# EasyEDA Pro project ProDoc_PCB1_2025-02-22.epro

# Board PCB1
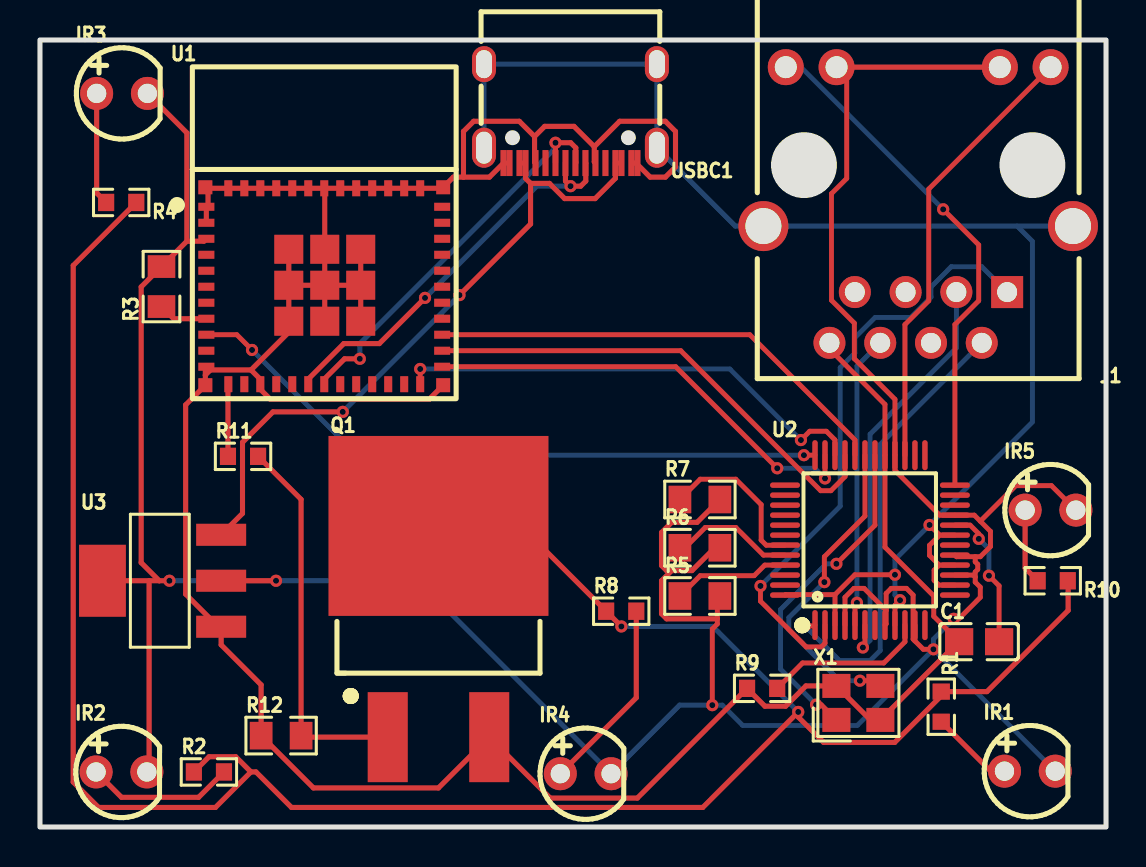
[diagram p0: board, top side]
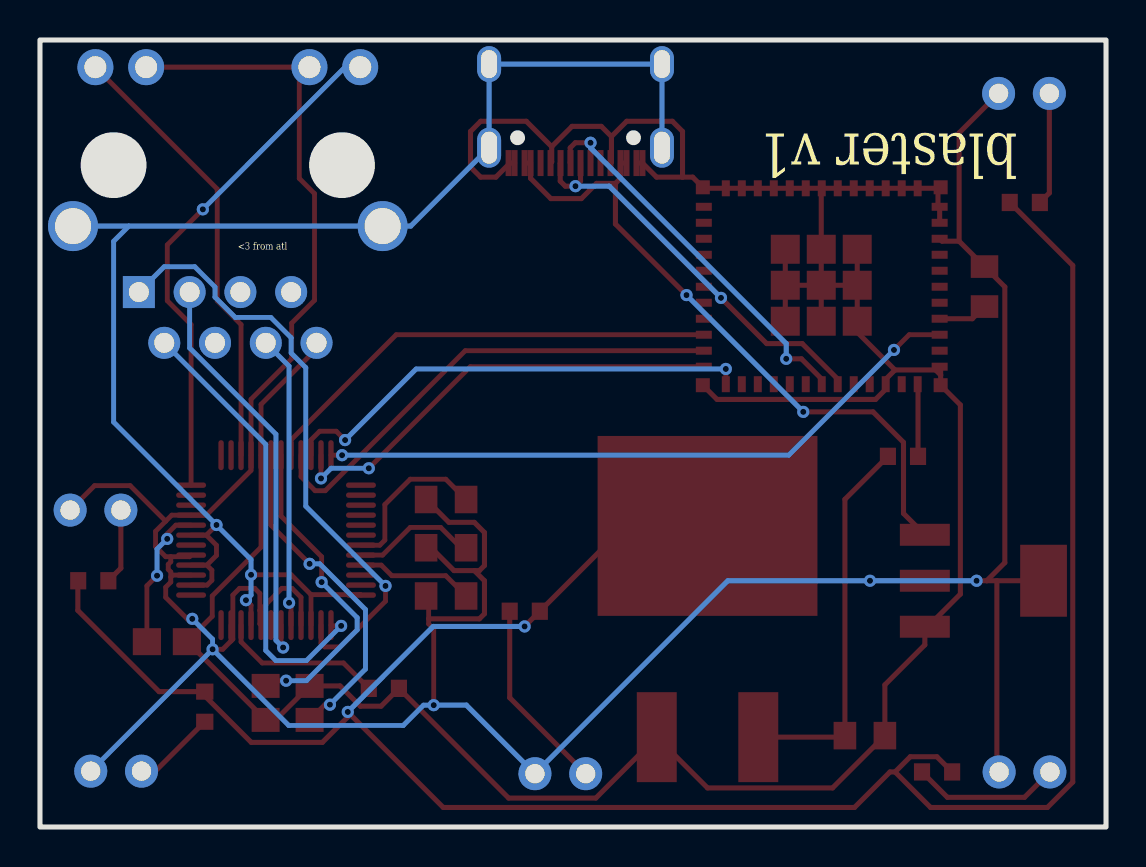
[diagram p1: board, bottom side, seen from below]

Outline 53.34 x 39.37 mm; copper layers: Top Layer, Inner1, Inner2, Bottom Layer. Coordinates in mm from the lower left corner of the outline.
Outline path: rectangle 0,39.37 53.34,0
Stack: Top Layer 0.035mm Outer layer thickness 1oz / Dielectric1 0.2104mm 7628 RC49% 8.6mil / Inner1 0.0152mm Inner layer thickness / Dielectric2 1.065mm 1.1mm H/HOZ Copper / Inner2 0.0152mm Inner layer thickness / Dielectric3 0.2104mm 7628 RC49% 8.6mil / Bottom Layer 0.035mm Outer layer thickness 1oz

## Design rules (mm)
template: JLCPCB Capability(Two Layers Board)
spacing copperThickness1oz (default): track to track 0.102, other pairs 0.152 to 0.3
spacing copperThickness2oz: track to track 0.203, other pairs 0.152 to 0.3
track width copperThickness1oz (default): min 0.127, default 0.254, max 2.54
track width copperThickness2oz: min 0.203, default 0.254, max 2.54
differential pair differentialPair (default): width min 0.127, default 0.254, max 2.54; gap min 0.152, default 0.152
via viaSize (default): diameter min 0.5, default 0.61, max 10; hole min 0.3, default 0.305, max 6.3

## Placement (name value [footprint] x y rotation side)
C1  4.7uF  [C0805]  46.99 9.27 0 top
IR1  HIR204C  [LED-TH_BD4.2-P2.54-FD]  49.53 2.79 0 top
IR2  HIR204C  [LED-TH_BD4.2-P2.54-FD]  4.08 2.75 0 top
IR3  HIR204C  [LED-TH_BD4.2-P2.54-FD]  4.11 36.7 0 top
IR4  HIR204C  [LED-TH_BD4.2-P2.54-FD]  27.3 2.67 0 top
IR5  HIR204C  [LED-TH_BD4.2-P2.54-FD]  50.56 15.85 0 top
J1  HR911105A  [RJ45-TH_HR911105A]  43.94 31.11 180 top
Q1  IRLZ34NSTRLPBF  [DPAK_L10.2-W9.1-P5.08-LS15.2-BL-CW]  19.94 9.78 0 top
R1  75Ω  [R0603]  45.1 6.02 270 top
R2  75Ω  [R0603]  8.45 2.75 0 top
R3  10kΩ  [R0805]  6.08 27.03 90 top
R4  75Ω  [R0603]  4.06 31.24 180 top
R5  10kΩ  [R0805]  33.02 11.56 0 top
R6  10kΩ  [R0805]  33.02 13.97 0 top
R7  10kΩ  [R0805]  33.02 16.38 0 top
R8  75Ω  [R0603]  29.08 10.8 0 top
R9  12.4kΩ  [R0603]  36.13 6.94 0 top
R10  75Ω  [R0603]  50.67 12.32 180 top
R11  220Ω  [R0603]  10.16 18.54 0 top
R12  10kΩ  [R0805]  12.06 4.57 0 top
U1  ESP32-C6-MINI-1-N4  [WIFIM-SMD_61P-L16.6-W13.2-P0.80-ESP32-C6-MINI-1-N4]  14.22 27.05 0 top
U2  W5500  [LQFP-48_L7.0-W7.0-P0.50-LS9.0-BL]  41.53 14.35 0 top
U3  AMS1117-3.3V  [SOT-223-3_L6.5-W3.4-P2.30-LS7.0-BR]  6.1 12.32 0 top
USBC1  TYPE-C-31-M-12  [USB-C_SMD-TYPE-C-31-M-12]  26.54 35.69 180 top
X1  25MHz  [CRYSTAL-SMD_4P-L3.2-W2.5-BL]  40.95 6.21 0 top

## Footprints (pads in the part's own frame, mm; a bottom-side part is the same pattern mirrored in y, then rotated)
C0805
  rect 1.41x1.35 smd: 1(-1,0) 2(1,0)
CRYSTAL-SMD_4P-L3.2-W2.5-BL
  rect 1.4x1.2 smd: 1(-1.1,-0.85) 2(1.1,-0.85) 3(1.1,0.85) 4(-1.1,0.85)
DPAK_L10.2-W9.1-P5.08-LS15.2-BL-CW
  rect 2x4.5 smd: 1(-2.54,-5.284) 3(2.54,-5.284)
  rect 11x9 smd: 2(0,5.284)
LED-TH_BD4.2-P2.54-FD
  round 1.651 hole 0.965: 1(-1.27,0) 2(1.27,0)
LQFP-48_L7.0-W7.0-P0.50-LS9.0-BL
  oval 0.27x1.5 smd: 1(-2.75,-4.25) 2(-2.25,-4.25) 3(-1.75,-4.25) 4(-1.25,-4.25) 5(-0.75,-4.25) 6(-0.25,-4.25) 7(0.25,-4.25) 8(0.75,-4.25) 9(1.25,-4.25) 10(1.75,-4.25) 11(2.25,-4.25) 12(2.75,-4.25) 25(2.75,4.25) 26(2.25,4.25) 27(1.75,4.25) 28(1.25,4.25) 29(0.75,4.25) 30(0.25,4.25) 31(-0.25,4.25) 32(-0.75,4.25) 33(-1.25,4.25) 34(-1.75,4.25) 35(-2.25,4.25) 36(-2.75,4.25)
  oval 1.5x0.27 smd: 13(4.25,-2.75) 14(4.25,-2.25) 15(4.25,-1.75) 16(4.25,-1.25) 17(4.25,-0.75) 18(4.25,-0.25) 19(4.25,0.25) 20(4.25,0.75) 21(4.25,1.25) 22(4.25,1.75) 23(4.25,2.25) 24(4.25,2.75) 37(-4.25,2.75) 38(-4.25,2.25) 39(-4.25,1.75) 40(-4.25,1.25) 41(-4.25,0.75) 42(-4.25,0.25) 43(-4.25,-0.25) 44(-4.25,-0.75) 45(-4.25,-1.25) 46(-4.25,-1.75) 47(-4.25,-2.25) 48(-4.25,-2.75)
R0603
  rect 0.806x0.864 smd: 1(-0.753,0) 2(0.753,0)
R0805
  rect 1.133x1.377 smd: 1(-1,0) 2(1,0)
RJ45-TH_HR911105A
  rect 1.6x1.6 hole 1: 1(-4.45,4.355)
  round 1.6 hole 1: 2(-3.18,6.895) 3(-1.91,4.355) 4(-0.64,6.895) 5(0.63,4.355) 6(1.9,6.895) 7(3.17,4.355) 8(4.44,6.895)
  round 1.8 hole 1.1: 9(-6.625,-6.895) 10(-4.085,-6.895) 11(4.085,-6.895) 12(6.625,-6.895)
  round 2.5 hole 1.8: SH1(-7.745,1.055) SH2(7.745,1.055)
SOT-223-3_L6.5-W3.4-P2.30-LS7.0-BR
  rect 2.5x1.1 smd: 1(2.97,-2.3) 2(2.97,0) 3(2.97,2.3)
  rect 2.34x3.6 smd: 4(-2.97,0)
USB-C_SMD-TYPE-C-31-M-12
  oval 1.2x2 hole 0.8x1.6: 0(-4.325,1.706) 1(4.325,1.706)
  oval 1.2x1.8 hole 0.8x1.4: 2(4.325,-2.474) 3(-4.325,-2.474)
  rect 0.3x1.3 smd: A1(-3.35,2.474) A4(-2.55,2.474) A5(-1.25,2.474) A6(-0.25,2.474) A7(0.25,2.474) A8(1.25,2.474) A9(2.55,2.474) A12(3.35,2.474) B1(3.05,2.474) B4(2.25,2.474) B5(1.75,2.474) B6(0.75,2.474) B7(-0.75,2.474) B8(-1.75,2.474) B9(-2.25,2.474) B12(-3.05,2.474)
WIFIM-SMD_61P-L16.6-W13.2-P0.80-ESP32-C6-MINI-1-N4
  rect 0.8x0.4 smd: 1(-5.9,3.975) 2(-5.9,3.175) 3(-5.9,2.375) 4(-5.9,1.575) 5(-5.9,0.775) 6(-5.9,-0.025) 7(-5.9,-0.825) 8(-5.9,-1.625) 9(-5.9,-2.425) 10(-5.9,-3.225) 11(-5.9,-4.025) 25(5.9,-4.025) 26(5.9,-3.225) 27(5.9,-2.425) 28(5.9,-1.625) 29(5.9,-0.825) 30(5.9,-0.025) 31(5.9,0.775) 32(5.9,1.575) 33(5.9,2.375) 34(5.9,3.175) 35(5.9,3.975)
  rect 0.4x0.8 smd: 12(-4.8,-4.9) 13(-4,-4.9) 14(-3.2,-4.9) 15(-2.4,-4.9) 16(-1.6,-4.9) 17(-0.8,-4.9) 18(0,-4.9) 19(0.8,-4.9) 20(1.6,-4.9) 21(2.4,-4.9) 22(3.2,-4.9) 23(4,-4.9) 24(4.8,-4.9) 36(4.8,4.9) 37(4,4.9) 38(3.2,4.9) 39(2.4,4.9) 40(1.6,4.9) 41(0.8,4.9) 42(0,4.9) 43(-0.8,4.9) 44(-1.6,4.9) 45(-2.4,4.9) 46(-3.2,4.9) 47(-4,4.9) 48(-4.8,4.9)
  rect 1.45x1.45 smd: 49(-1.775,1.85) 49(-1.775,0.05) 49(-1.775,-1.75) 49(0.025,1.85) 49(0.025,0.05) 49(0.025,-1.75) 49(1.825,1.85) 49(1.825,0.05) 49(1.825,-1.75)
  rect 0.7x0.7 smd: 50(5.95,4.95) 51(5.95,-4.95) 52(-5.95,-4.95) 53(-5.95,4.95)

## Nets
+5V: U3.3 USBC1.A4 USBC1.A9 USBC1.B4 USBC1.B9
AGND: J1.SH1 J1.SH2 U2.3 U2.9 U2.14 U2.16 U2.19 U2.48 USBC1.0 USBC1.1 USBC1.2 USBC1.3
GND: C1.1 J1.8 Q1.3 R9.1 R12.1 U1.1 U1.2 U1.11 U1.14 U1.36 U1.37 U1.38 U1.39 U1.40 U1.41 U1.42 U1.43 U1.44 U1.45 U1.46 U1.47 U1.48 U1.49 U1.50 U1.51 U1.52 U1.53 U2.29 U3.1 USBC1.A1 USBC1.A5 USBC1.A12 USBC1.B1 USBC1.B5 USBC1.B12 X1.2 X1.4
VCC: IR1.2 IR2.2 IR3.2 IR4.2 IR5.2 J1.10 J1.11 R3.2 R5.2 R6.2 R7.2 U1.3 U2.4 U2.8 U2.11 U2.15 U2.17 U2.21 U2.28 U3.2 U3.4
ACTLED: J1.9 U2.27
CLK: U1.26 U2.33
CS: U1.27 U2.32
DRAIN: Q1.2 R1.1 R2.1 R4.1 R8.1 R10.1
INT: U1.9 U2.36
IO0: R11.1 U1.12
MISO: U1.24 U2.34
MOSI: U1.25 U2.35
RXN: J1.6 U2.5
RXP: J1.3 U2.6
SPDLED: J1.12 U2.24
TXN: J1.2 U2.1
TXP: J1.1 U2.2
USBDM: U1.17 USBC1.A7 USBC1.B7
USBDP: U1.18 USBC1.A6 USBC1.B6
$1N1656: C1.2 U2.20
$1N1729: R9.2 U2.10
$1N1975: U2.31 X1.3
$1N1980: U2.30 X1.1
$1N2898: R5.1 U2.45
$1N2937: R6.1 U2.44
$1N2976: R7.1 U2.43
$1N3133: R3.1 U1.8
$1N4218: Q1.1 R11.2 R12.2
$1N5126: IR1.1 R1.2
$1N5129: IR2.1 R2.2
$1N5132: IR3.1 R4.2
$1N5135: IR4.1 R8.2
$1N5138: IR5.1 R10.2

Pads without a net: J1 4 5 7; U1 4 5 6 7 10 13 15 16 19 20 21 22 23 28 29 30 31 32 33 34 35; U2 7 12 13 18 22 23 25 26 37 38 39 40 41 42 46 47; USBC1 A8 B8

## Via types
v1: diameter 0.61, hole 0.305, Top Layer to Bottom Layer, 33 vias

## Routing (per net, layer and track width the routed paths; a pad name or vN(x,y) marks a point on that pad's centre or on a via; arc(x,y) is an arc through that point)
+5V: length 33.5
  Top Layer w0.254: v1(20.99,26.61) 24.55,30.16 24.55,32.2 ; v1(15.15,20.77) 11.66,20.77 10.13,19.24 10.13,15.69 U3.3 ; 24.55,32.2 24.29,32.45 USBC1.B4 USBC1.A9 ; 24.55,32.2 25.49,32.2 26.25,31.44 27.78,31.44 28.79,32.45 USBC1.B9 USBC1.A4
  Bottom Layer w0.254: v1(20.99,26.61) v1(15.15,20.77)
AGND: length 76.4
  Top Layer w0.243: 39.78,11.62 37.3,11.62 U2.48 ; 39.78,11.62 40.77,12.62 v1(42.78,12.62) ; 39.78,11.62 U2.3 ; 44.99,13.1 44.51,13.58 44.51,14.09 45.02,14.6 ; 44.99,13.1 44.74,12.85 44.74,12.34 44.98,12.1 U2.14 ; 44.99,13.1 U2.16 ; v1(44.51,15.11) 45.02,14.6 ; 45.02,14.6 U2.19 ; U2.9 42.78,11.09 v1(43.03,11.35)
  Bottom Layer w0.243: v1(43.03,11.35) 42.78,11.6 v1(42.78,12.62) 42.78,13.38 v1(44.51,15.11) 49.65,20.25 49.65,29.3 48.89,30.06
  Bottom Layer w0.254: 51.69,30.06 34.79,30.06 USBC1.0 USBC1.3 USBC1.2 USBC1.1
GND: length 154.9
  Top Layer w0.243: J1.8 39.5,23.92 42.28,21.14 U2.29 42.28,14 44.72,11.56 44.72,10.54 C1.1
  Top Layer w0.254: U1.49 U1.49 ; U1.49 U1.49 ; U1.49 U1.49 ; 9.07,9.87 U3.1 ; 9.07,9.87 9.07,9.11 11.06,7.11 R12.1 13.68,1.96 19.94,1.96 Q1.3 25.53,1.45 29.89,1.45 R9.1 36.27,6.04 37.31,6.04 38.32,7.06 X1.4 41.55,5.36 X1.2 45.96,9.27 C1.1 ; 9.07,9.87 7.29,11.65 7.29,21.11 U1.52 8.27,22.61 ; U1.42 14.25,31.93 U1.49 U1.49 ; U1.42 U1.41 U1.40 U1.39 U1.38 U1.37 U1.36 20.12,31.95 U1.50 20.68,32.51 21.19,32.51 ; U1.42 U1.43 U1.44 U1.45 U1.46 U1.47 U1.48 8.41,31.95 ; 21.19,32.51 22.49,32.51 USBC1.A12 USBC1.B1 ; 21.19,32.51 21.19,34.8 21.7,35.3 23.98,35.3 24.75,34.54 ; USBC1.A5 27.73,33.27 27.73,34.03 ; 29.83,33.21 USBC1.B12 ; 29.83,33.21 30.53,32.51 31.29,32.51 31.8,33.02 31.8,34.8 31.29,35.3 29,35.3 27.73,34.03 ; 29.83,33.21 USBC1.A1 ; 8.27,22.61 8.53,22.86 10.56,22.86 ; 8.27,22.61 8.27,22.98 U1.11 ; 8.41,31.95 8.41,31.11 U1.1 U1.2 ; 8.41,31.95 U1.53 ; 27.73,34.03 26.72,35.05 25.25,35.05 24.75,34.54 ; 24.75,34.54 24.75,33.26 USBC1.B5 ; U1.49 U1.49 12.45,24.75 10.56,22.86 ; U1.49 U1.49 ; U1.49 U1.49 ; U1.49 U1.49 ; U1.51 19.46,21.39 11.53,21.39 11.02,21.9 U1.14 11.02,22.4 10.56,22.86
VCC: length 180.7
  Top Layer w0.243: v1(44.7,8.89) 44.2,8.89 43.78,9.31 ; 46.8,13.52 46.8,13.27 46.92,13.14 46.92,12.89 46.8,12.76 46.8,12.5 ; 46.8,13.52 47.05,13.52 47.56,14.03 47.56,14.79 47.05,15.3 ; 46.8,13.52 45.86,13.52 U2.17 ; 47.05,15.3 48.83,17.08 50.61,17.08 IR5.2 ; 47.05,15.3 46.75,15.6 U2.21 45.02,15.6 42.78,17.84 U2.28 42.78,21.39 40.75,23.43 40.75,25.2 39.6,26.35 39.6,31.68 40.36,32.44 40.36,37.5 J1.11 ; 42.34,10.84 42.34,11.68 42.59,11.94 43.35,11.94 43.69,11.6 43.69,9.4 43.78,9.31 ; 42.34,10.84 42.34,10.16 U2.8 ; 42.34,10.84 41.24,11.94 40.73,11.94 40.28,11.49 U2.4 ; 46.8,12.5 46.8,12.25 47.05,12 47.05,11.49 45.97,10.41 v1(45.72,10.41) ; 46.8,12.5 46.7,12.6 U2.15 ; v1(33.64,6.1) 33.64,9.91 33.89,10.16 33.89,11.43 R5.2 ; 43.78,9.31 U2.11
  Top Layer w0.254: 5.46,12.32 U3.4 ; 5.46,12.32 5.46,2.87 IR2.2 ; 5.46,12.32 5.97,12.32 ; 31.61,12.83 32.62,12.83 33.64,13.84 33.89,13.84 R6.2 ; 31.61,12.83 31.35,12.83 31.1,13.08 31.1,14.73 31.61,15.24 32.88,15.24 R7.2 ; 31.61,12.83 31.1,12.32 31.1,10.67 31.35,10.41 33.89,10.41 ; U1.3 8.2,29.3 7.35,29.3 ; v1(6.48,12.32) 5.97,12.32 ; 5.97,12.32 5.06,13.22 5.06,27.02 R3.2 7.35,29.3 ; 7.35,29.3 7.35,34.72 IR3.2 ; J1.11 J1.10 ; v1(11.81,12.32) U3.2
  Bottom Layer w0.243: v1(44.7,8.89) 44.7,9.4 v1(45.72,10.41) ; v1(44.7,8.89) IR1.2 ; v1(44.7,8.89) 40.89,5.08 35.16,5.08 34.15,6.1 v1(33.64,6.1)
  Bottom Layer w0.254: v1(33.64,6.1) 32,6.1 IR4.2 18.92,12.32 v1(11.81,12.32) v1(6.48,12.32)
ACTLED: length 22.4
  Top Layer w0.243: J1.9 44.47,31.91 44.47,26.33 43.28,25.13 U2.27
CLK: length 24.4
  Top Layer w0.243: 20.12,23.83 32.06,23.83 39.06,16.82 39.57,16.82 40.28,17.53 U2.33
CS: length 23.6
  Top Layer w0.243: 20.12,24.63 35.52,24.63 40.78,19.36 U2.32
DRAIN: length 114.5
  Top Layer w0.254: v1(29.09,10.03) R8.1 24.06,15.06 Q1.2 ; R4.1 1.66,28.09 1.66,2.25 2.93,0.98 8.78,0.98 10.55,2.75 ; 10.55,2.75 10.81,2.75 12.59,0.98 33.16,0.98 v1(37.94,5.76) 37.94,5.5 39.21,4.23 42.77,4.23 45.05,6.52 45.05,6.73 R1.1 47.38,6.77 51.45,10.84 51.45,12.3 R10.1 ; 10.55,2.75 9.79,3.52 8.46,3.52 R2.1
  Bottom Layer w0.254: v1(29.09,10.03) 33.66,10.03 v1(37.94,5.76)
INT: length 33
  Top Layer w0.243: v1(10.61,23.86) 9.85,24.63 8.32,24.63 ; v1(38.23,18.6) U2.36
  Bottom Layer w0.243: v1(38.23,18.6) 15.87,18.6 v1(10.61,23.86)
IO0: length 3.6
  Top Layer w0.254: R11.1 9.41,22.13 U1.12
MISO: length 24.1
  Top Layer w0.243: U2.34 39.78,19.36 39.34,19.8 38.52,19.8 v1(38.07,19.36) ; U1.24 v1(19.02,22.91)
  Bottom Layer w0.243: v1(38.07,19.36) 34.52,22.91 v1(19.02,22.91)
MOSI: length 22.6
  Top Layer w0.243: v1(36.89,17.95) 31.81,23.03 U1.25 ; v1(39.28,17.44) U2.35
  Bottom Layer w0.243: v1(39.28,17.44) 38.77,17.95 v1(36.89,17.95)
RXN: length 14.6
  Top Layer w0.243: U2.5 40.78,11.12 v1(40.88,11.21)
  Bottom Layer w0.243: v1(40.88,11.21) 40.88,23.05 J1.6
RXP: length 20.9
  Top Layer w0.243: U2.6 41.28,9.08 v1(41.17,8.98)
  Bottom Layer w0.243: J1.3 45.85,23.97 41.53,19.65 41.53,9.34 v1(41.17,8.98)
SPDLED: length 25.8
  Top Layer w0.243: U2.24 45.78,25.14 46.97,26.33 46.97,29.12 v1(45.19,30.9)
  Bottom Layer w0.243: v1(45.19,30.9) 38.08,38.01 J1.12
TXN: length 22.7
  Top Layer w0.243: U2.1 38.74,10.06 v1(38.27,10.06)
  Bottom Layer w0.243: J1.2 42.04,19.14 42.04,8.83 41.53,8.32 40.01,8.32 v1(38.27,10.06)
TXP: length 30.2
  Top Layer w0.243: v1(36.05,12.06) 36.05,11.3 38.34,9.01 39.1,9.01 39.28,9.19 U2.2
  Bottom Layer w0.243: J1.1 47.12,28.03 45.6,28.03 44.58,27.01 44.58,26.51 43.57,25.49 41.79,25.49 40.77,24.47 40.77,23.71 40.04,22.98 40.04,16.05 v1(36.05,12.06)
USBDM: length 20.4
  Top Layer w0.254: U1.17 13.42,22.41 15.2,24.18 16.98,24.18 v1(19.27,26.47) ; USBC1.A7 26.29,32.31 v1(26.55,32.06) 27.05,32.06 27.31,32.31 27.31,33.2 USBC1.B7
  Bottom Layer w0.254: v1(19.27,26.47) 24.85,32.06 v1(26.55,32.06)
USBDP: length 20.2
  Top Layer w0.254: USBC1.B6 v1(25.79,34.23) 26.56,34.23 26.81,33.97 26.81,33.23 USBC1.A6 ; U1.18 14.22,22.41 15.24,23.42 v1(16,23.42)
  Bottom Layer w0.254: v1(16,23.42) 16,24.18 25.79,33.97 v1(25.79,34.23)
$1N1656: length 7.2
  Top Layer w0.243: C1.2 47.99,12.06 v1(47.48,12.57) ; U2.20 46.54,15.1 46.97,14.67 v1(46.97,14.41)
  Bottom Layer w0.243: v1(46.97,14.41) 47.48,13.91 v1(47.48,12.57)
$1N1729: length 8.2
  Top Layer w0.243: U2.10 43.28,9.27 42.22,8.21 38.16,8.21 R9.2
$1N1975: length 16.1
  Top Layer w0.243: v1(41.02,7.32) 41.79,7.32 X1.3 ; U2.31 41.28,15.55 39.25,13.52 v1(39.25,12.25)
  Bottom Layer w0.243: v1(41.02,7.32) 40.01,7.32 37.47,9.86 37.47,10.47 v1(39.25,12.25)
$1N1980: length 16.8
  Top Layer w0.243: v1(38.83,6.12) 39.09,6.12 X1.1 ; v1(39.85,13.17) 41.78,15.1 U2.30
  Bottom Layer w0.243: v1(38.83,6.12) 37.05,7.9 37.05,10.88 39.34,13.17 v1(39.85,13.17)
$1N2898: length 5.9
  Top Layer w0.243: U2.45 36.26,13.1 35.73,12.57 33.04,12.57 R5.1
$1N2937: length 6.3
  Top Layer w0.243: R6.1 32.27,13.97 33.29,14.99 34.81,14.99 36.2,13.6 U2.44
$1N2976: length 8.1
  Top Layer w0.243: R7.1 33.04,17.4 34.81,17.4 36.08,16.13 36.08,14.35 36.34,14.1 37.27,14.1
$1N3133: length 2.5
  Top Layer w0.254: U1.8 6.69,25.43 R3.1
$1N4218: length 19.2
  Top Layer w0.254: R11.2 13.06,16.39 R12.2 13.14,4.5 Q1.1
$1N5126: length 4.2
  Top Layer w0.254: R1.2 47.57,2.79 IR1.1
$1N5129: length 7.5
  Top Layer w0.254: 9.21,2.75 7.94,1.48 4.08,1.48 IR2.1
$1N5132: length 5.7
  Top Layer w0.254: R4.2 2.84,31.72 IR3.1
$1N5135: length 9.7
  Top Layer w0.254: R8.2 29.84,6.47 IR4.1
$1N5138: length 3.8
  Top Layer w0.254: R10.2 49.29,12.95 IR5.1

## Copper pours and planes (outline as drawn; the poured copper is in the pictures)
GND on Inner1: 0.63,38.99 52.83,38.99 52.83,0.38 0.63,0.38
VCC on Inner2: 0.63,38.99 52.96,38.99 52.96,0.51 0.63,0.51

## Text on the board
Bottom Silkscreen Layer: <3 from atl | blaster v1
